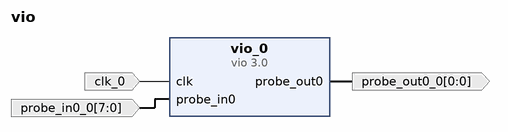
[diagram p0: block diagram of the top level]
# Vivado block design vio, xc7z020clg484-1, Vivado 2021.1.1
create_bd_design vio

create_bd_port -dir I -type clk clk_0
create_bd_port -dir I -from 7 -to 0 probe_in0_0
create_bd_port -dir O -from 0 -to 0 probe_out0_0

create_bd_cell -type ip -vlnv xilinx.com:ip:vio:3.0 vio_0
set_property -dict {CONFIG.C_NUM_PROBE_IN 1} [get_bd_cells vio_0]

# ---- connections ----

connect_bd_net -net clk_0_1 [get_bd_ports clk_0] [get_bd_pins vio_0/clk]
connect_bd_net -net probe_in0_0_1 [get_bd_ports probe_in0_0] [get_bd_pins vio_0/probe_in0]
connect_bd_net [get_bd_pins vio_0/probe_out0] [get_bd_ports probe_out0_0]

validate_bd_design
save_bd_design
